# EAGLE design M8Breakout4 (EAGLE 9.5.2)
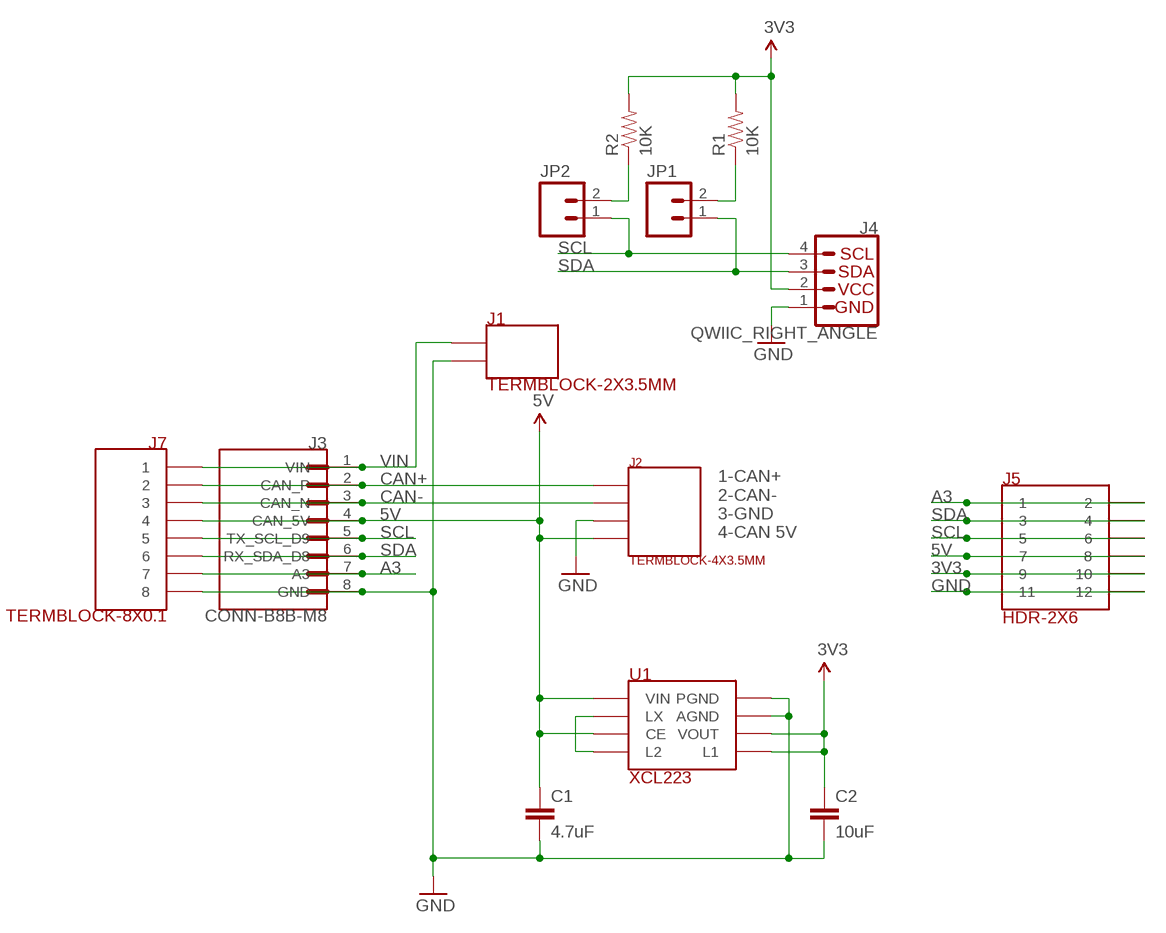
[diagram p0: schematic, sheet 1]

## Parts
C1  4.7uF  CAP-4.7UF-0603  [0603-CAP]
C2  10uF  CAP-10UF-0603  [0603-CAP]
J1  TERMBLOCK-2X3.5MM  [TERMBLOCK-2X3.5MM]
J2  TERMBLOCK-4X3.5MM  [TERMBLOCK-4X3.5MM]
J3  CONN-B8B-M8  [JST_B8B-PH-SM4-TB(LF)(SN)]
J4  QWIIC_RIGHT_ANGLE  QWIIC_CONNECTORJS-1MM  [JST04_1MM_RA]
J5  HDR-2X6  [HDR-2X6-F-SMD-NO-HOLES]
J7  TERMBLOCK-8X0.1  [TERMBLOCK-8X0.1]
JP1  M02PTH  [1X02]
JP2  M02PTH  [1X02]
R1  10K  RES-10K-06030603  [0603-RES]
R2  10K  RES-10K-06030603  [0603-RES]
U1  XCL223  REG-XCL223  [REG-XCL223-LESS-CREAM]

## Nets
3V3: C2.1 J4.2 J5.9 J5.10 R1.2 R2.2 U1.3(VOUT) U1.7(L1)
5V: C1.1 J2.4 J3.4(CAN_5V) J5.7 J5.8 J7.P$4 U1.4(CE) U1.6(VIN)
A3: J3.7(A3) J5.1 J5.2 J7.P$7
CAN+: J2.1 J3.2(CAN_P) J7.P$2
CAN-: J2.2 J3.3(CAN_N) J7.P$3
GND: C1.2 C2.2 J1.2 J2.3 J3.8(GND) J4.1 J5.11 J5.12 J7.P$8 U1.1(PGND) U1.2(AGND)
LX: U1.5(LX) U1.8(L2)
N$1: JP2.2 R2.1
N$3: JP1.2 R1.1
SCL: J3.5(TX_SCL_D9) J4.4 J5.5 J5.6 J7.P$5 JP2.1
SDA: J3.6(RX_SDA_D8) J4.3 J5.3 J5.4 J7.P$6 JP1.1
VIN: J1.1 J3.1(VIN) J7.P$1

## Notes on the sheet
- 1-CAN+
  2-CAN-
  3-GND
  4-CAN 5V

## Library data of the parts
C1 = rickk2:CAP-4.7UF-0603: Murata X5R series CAP CER 4.7UF 6.3V X5R 0603 $0.12 https://www.digikey.com/product-detail/en/murata-electronics-north-america/GRM188R60J475KE19J/490-6407-1-ND/3845604
C2 = rickk2:CAP-10UF-0603: CAP CER 10UF 16V X5R 0805 $ 0.21 https://www.digikey.com/product-detail/en/murata-electronics-north-america/GRM21BR61C106KE15L/490-3886-1-ND/965928
J1 = rickk2:TERMBLOCK-2X3.5MM: TERM BLK 2POS SIDE ENT 3.5MM PCB $0.67 On Shore Technology Inc. OSTTE020161M https://www.digikey.com/products/en?keywords=ED2635-ND
J2 = rickk2:TERMBLOCK-4X3.5MM: TERM BLK 4POS SIDE ENT 3.5MM PCB On Shore Technology Inc. OSTTE040161 $1.01 4 Position Wire to Board Terminal Block Horizontal with Board 0.138" (3.50mm) Through Hole https://www.digikey.com/product-detail/en/on-shore-technology-inc/OSTTE040161/ED2637-ND/614586
J3 = rickk2:CONN-B8B-M8: PH Series 2 mm Pitch 12 Position SMT Single Row Top Entry Shrouded Header
J4 = rickk2:QWIIC_CONNECTOR: SparkFun I2C Standard Qwiic Connector An SMD 1mm pitch JST connector makes it easy and quick (get it? Qwiic?) to connect I2C devices to each other. The Qwiic system <http://www.sparkfun.com/qwiic> enables fast and solderless connection between popular platforms and various sensors and actuators. We carry 200mm <https://www.sparkfun.com/products/14204>, 100mm <https://www.sparkfun.com/products/14205>, 50mm <https://www.sparkfun.com/products/14206>, and breadboard friendly <https://www.sparkfun.com/products/14207> Qwiic cables. We also offer 10 pcs strips <https://www.sparkfun.com/products/14323> the SMD connectors.; PROD_ID: CONN-13694
J5 = rickk2:HDR-2X6: CONN HDR 12POS 0.1 GOLD Female SMD Sullins Connector Solutions NPPC062KFMS-RC $1.74 12 Position Header Connector Surface Mount https://www.digikey.com/product-detail/en/sullins-connector-solutions/NPPC062KFMS-RC/S5715-ND/776174
J7 = rickk2:TERMBLOCK-8X0.1: Term Block 8x0.1" 20-30AWG 6A 125V Max Side Entry On Shore Technology Inc. OSTVN08A150 TERM BLK 8P SIDE ENT 2.54MM PCB 8 Position Wire to Board Terminal Block Horizontal with Board 0.100" (2.54mm) Through Hole https://www.digikey.com/product-detail/en/on-shore-technology-inc/OSTVN08A150/ED10566-ND/1588868
JP1 JP2 = rickk2:M02: Standard 2-pin 0.1" header. Use with - straight break away headers ( PRT-00116) - right angle break away headers (PRT-00553) - swiss pins (PRT-00743) - machine pins (PRT-00117) - female headers (PRT-00115) Molex polarized connector foot print use with: PRT-08233 with associated crimp pins and housings. 2.54_SCREWTERM for use with PRT-10571. 3.5mm Screw Terminal footprints for PRT-08084 5mm Screw Terminal footprints for use with PRT-08432
R1 R2 = rickk2:RES-10K-0603: RES SMD 10K OHM 5% 1/4W 0603 $ 0.10 https://www.digikey.com/product-detail/en/panasonic-electronic-components/ERJ-PA3J103V/P10KBZCT-ND/5036237
U1 = rickk2:REG-XCL223: Manufacturer: Torex Semiconductor Ltd Manufacturer Part Number: XCL223A333D2-G DC DC CONVERTER 3.3V Detailed Description: Non-Isolated PoL Modul $2.63 https://www.digikey.com/product-detail/en/torex-semiconductor-ltd/XCL223A333D2-G/893-1416-1-ND/8256118 CIN=4.7uF 10V CL = 10uF 10V VIN MAX=5.5V VOUT=3.3V

## Board
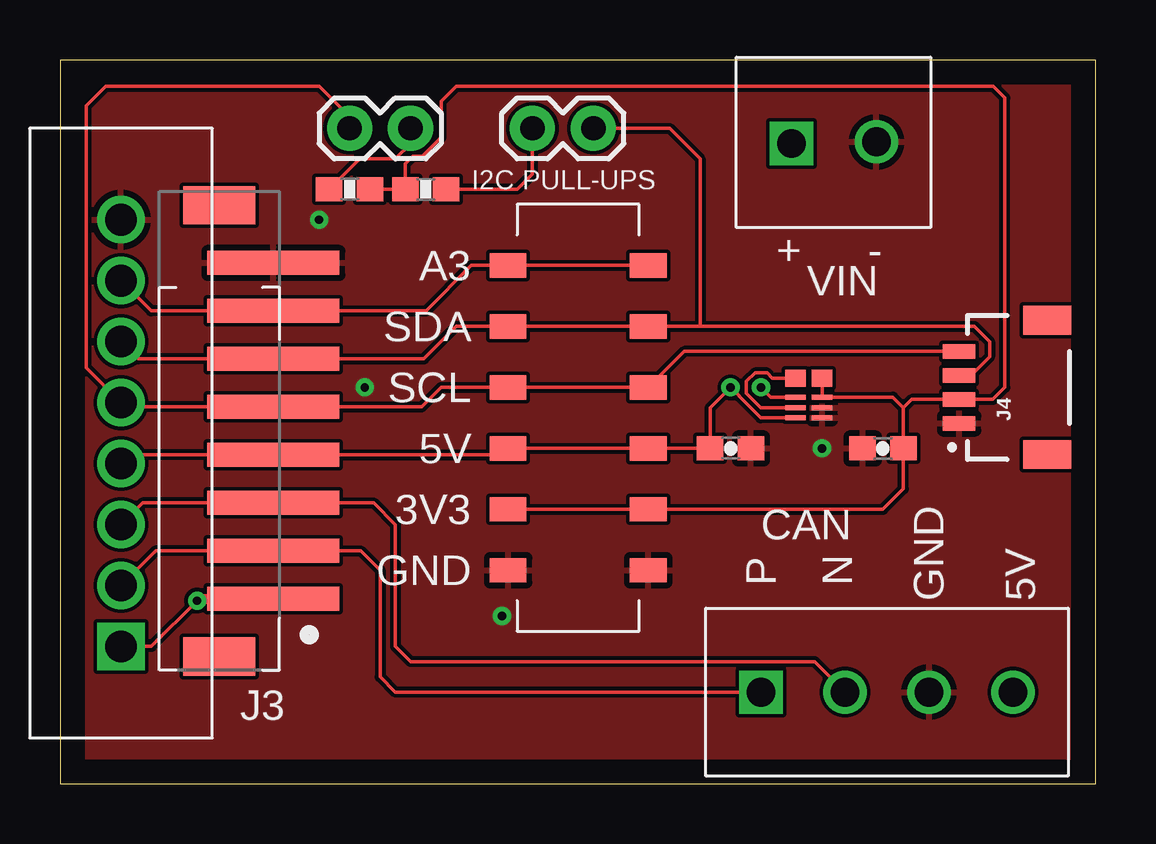
[diagram p1: board, top side]
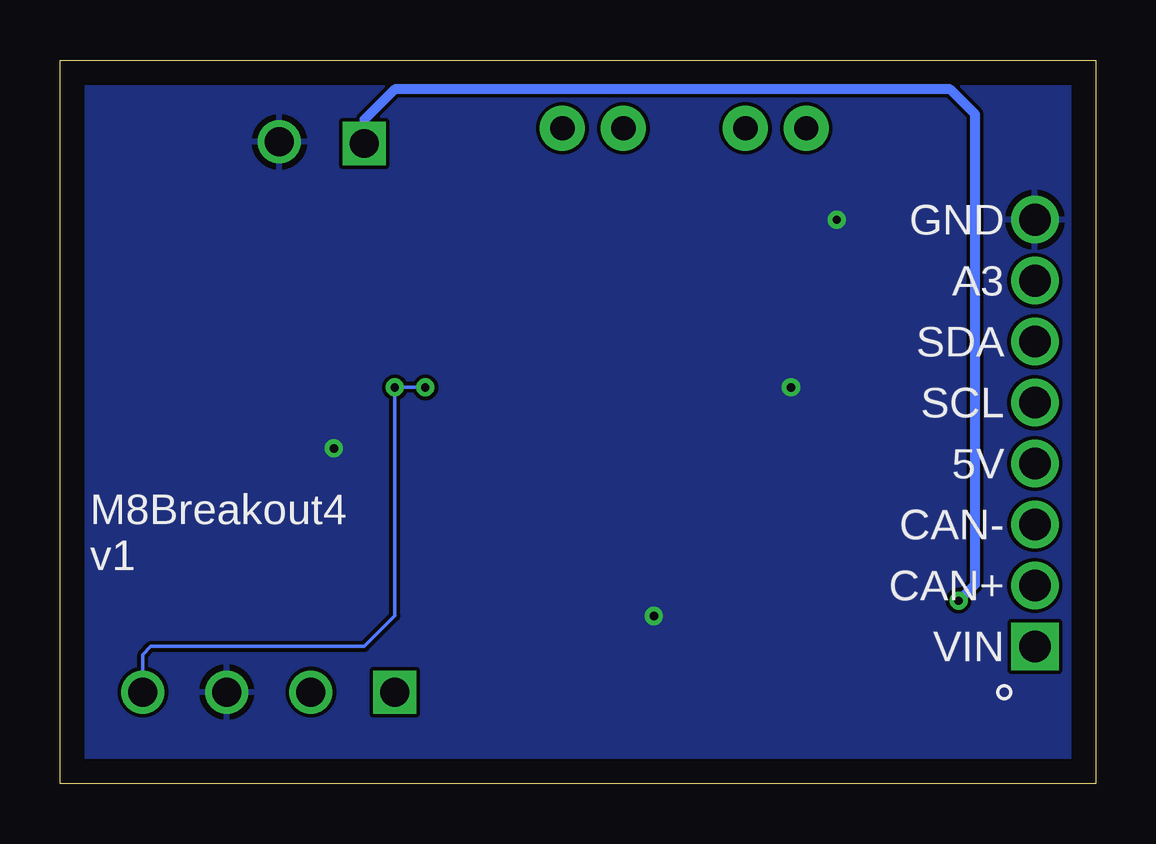
[diagram p2: board, bottom side, seen from below]

Size 43.16 x 30.15 mm. Coordinates in mm from the lower left corner, seen from the top.
Outline: 0,0 43.16,0 43.16,30.15 0,30.15 0,0
Copper layers (1*16): Top 0.035mm / dielectric 1.5mm / Bottom 0.035mm
Design rules "default": minimum track width 6mil, minimum drill 0.35mm, track to track 6mil, track to pad 6mil, pad to pad 6mil, via to via 6mil, smd to smd 6mil, copper to edge 40mil, drill to drill 6mil, minimum pad ring 10mil, minimum via ring 8mil, stop-mask expansion 4mil, vias tented up to drill 0mil, thermal gap 10mil

### Footprints (pad centres in the part's own frame; a part is rotated, then mirrored left to right if it is on the bottom)
0603-CAP = smd 1.1 x 1: 1 -0.85,0; 2 0.85,0
TERMBLOCK-2X3.5MM = drill 1.2 square: 1 0,0 | drill 1.2: 2 3.54,0.07
TERMBLOCK-4X3.5MM = drill 1.2 square: 1 0,0 | drill 1.2: 2 3.5,0; 3 7,0; 4 10.5,0
JST_B8B-PH-SM4-TB(LF)(SN) = smd 1 x 5.5: 1 -5,0; 2 -3,0; 3 -1,0; 4 1,0; 5 3,0; 6 5,0; 7 7,0; 8 9,0 | smd 1.6 x 3: P1 -7.4,2.25; P2 11.4,2.25
JST04_1MM_RA = smd 0.6 x 1.35: 1 -1.5,0; 2 -0.5,0; 3 0.5,0; 4 1.5,0 | smd 1.2 x 2: NC1 2.8,-3.675; NC2 -2.8,-3.675
HDR-2X6-F-SMD-NO-HOLES = smd 1.016 x 1.524: 1 0,-2.921; 2 0,2.921; 3 2.54,-2.921; 4 2.54,2.921; 5 5.08,-2.921; 6 5.08,2.921; 7 7.62,-2.921; 8 7.62,2.921; 9 10.16,-2.921; 10 10.16,2.921; 11 12.7,-2.921; 12 12.7,2.921
TERMBLOCK-8X0.1 = drill 1.321 square: P$1 -8.89,0 | drill 1.321: P$2 -6.35,0; P$3 -3.81,0; P$4 -1.27,0; P$5 1.27,0; P$6 3.81,0; P$7 6.35,0; P$8 8.89,0
1X02 = drill 1.016 pad 1.88: 1 0,0; 2 2.54,0
0603-RES = smd 1.1 x 1: 1 -0.85,0; 2 0.85,0
REG-XCL223-LESS-CREAM = smd 0.85 x 0.21: 1 0,0; 2 0,0.43; 3 0,0.86; 4 -1.11,0.86; 5 -1.11,0.43; 6 -1.11,0 | smd 0.85 x 0.7: 7 0,1.655; 8 -1.11,1.655

### Placement (x,y rotation side)
C1  27.94,13.97 0 top
C2  34.29,13.97 180 top
J1  30.48,26.67 0 top
J2  29.21,3.81 0 top
J3  8.89,12.7 90 top
J4  37.47,16.51 90 top
J5  21.59,21.59 270 top
J7  2.54,14.61 90 top
JP1  22.23,27.3 180 top
JP2  12.06,27.3 0 top
R1  15.24,24.77 180 top
R2  12.06,24.77 0 top
U1  31.75,15.24 0 top

### Tracks (layer width: path | path; a pad name or v marks a point on that pad's centre or on a via)
3V3
  Top 0.152: U1.7 U1.3 34.7,16.1 35.14,15.66 | 35.14,15.66 C2.1 35.14,12.28 34.29,11.43 J5.10 J5.9 | 35.14,15.66 35.49,16.01 J4.2 38.87,16.01 39.37,16.51 39.37,28.57 38.89,29.06 16.51,29.06 15.88,28.42 15.88,26.92 15.09,26.14 14.71,26.14 14.39,25.82 R1.2 R2.2
5V  (via drill 0.35)
  Top 0.152: J7.P$4 2.9,13.7 J3.4 18.4,13.7 J5.7 J5.8 C1.1 27.09,15.66 v27.94,16.51 28.3,16.15 28.3,16.13 29.19,15.24 U1.6 | U1.4 29.62,16.1 v29.21,16.51
  Bottom 0.152: v27.94,16.51 v29.21,16.51 29.21,6.99 30.48,5.71 39.37,5.71 39.71,5.38 J2.4
A3
  Top 0.152: J7.P$7 3.79,19.7 J3.7 15.22,19.7 15.24,19.68 17.14,21.59 J5.1 J5.2
CAN+
  Top 0.152: J2.1 13.97,3.81 13.34,4.45 13.34,8.89 12.53,9.7 J3.2 3.98,9.7 J7.P$2
CAN-
  Top 0.152: J2.2 31.44,5.08 14.61,5.08 13.97,5.71 13.97,10.79 13.06,11.7 J3.3 3.44,11.7 J7.P$3
GND  (via drill 0.35)
  other vias: 31.75,13.97 18.41,6.99 10.79,23.5 12.7,16.51
  pour Top: 0,0 0,31.75 50.8,31.75 50.8,0
  pour Bottom: 0,0 0,31.75 52.07,31.75 52.07,0
LX
  Top 0.152: U1.8 29.68,16.89 29.46,17.12 28.96,17.12 28.6,16.76 28.6,16.26 29.19,15.67 U1.5
N$1
  Top 0.152: R2.1 12.48,26.04 13.97,26.04 14.61,26.67 JP2.2
N$3
  Top 0.152: JP1.2 19.68,25.4 19.05,24.77 R1.1
SCL
  Top 0.152: J4.4 26.01,18.01 J5.6 J5.5 15.88,16.51 15.06,15.7 J3.5 2.71,15.7 J7.P$5 1.09,17.32 1.09,28.25 1.91,29.06 10.79,29.06 12.06,27.79 JP2.1
SDA
  Top 0.152: 26.67,19.05 J5.4 J5.3 16.51,19.05 15.16,17.7 J3.6 3.25,17.7 J7.P$6 | 26.67,19.05 38.1,19.05 38.73,18.41 38.73,17.78 37.97,17.01 J4.3 | JP1.1 25.4,27.3 26.67,26.04 26.67,19.05
VIN  (via drill 0.35)
  Top 0.152: v5.71,7.62 3.81,5.71 J7.P$1
  Top 0.406: v5.71,7.62 5.79,7.7 J3.1
  Bottom 0.406: J1.1 30.48,27.66 29.21,28.93 6.07,28.93 5.03,27.89 5.03,8.31 v5.71,7.62

### Text on the board
tPlace: I2C PULL-UPS | A3 | + | - | SDA | VIN | SCL | 5V | 3V3 | GND | CAN | P | N | GND | 5V
bPlace: GND | A3 | SDA | SCL | 5V | CAN- | CAN+ | M8Breakout4 / v1 | VIN